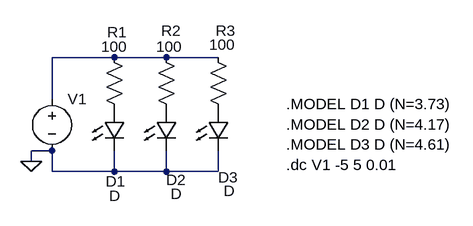
[diagram p0: schematic 131_LED.asc]
131_LED.asc, the LTspice schematic file:
Version 4
SHEET 1 880 680
WIRE 272 240 176 240
WIRE 352 240 272 240
WIRE 432 240 352 240
WIRE 176 304 176 240
WIRE 176 384 144 384
WIRE 144 400 144 384
WIRE 176 416 176 384
WIRE 272 416 272 384
WIRE 272 416 176 416
WIRE 352 416 352 384
WIRE 352 416 272 416
WIRE 432 416 432 384
WIRE 432 416 352 416
FLAG 144 400 0
SYMBOL voltage 176 288 R0
SYMATTR InstName V1
SYMATTR Value ""
SYMBOL Res 256 224 R0
WINDOW 0 5 -23 Left 2
WINDOW 3 -4 -1 Left 2
SYMATTR InstName R1
SYMATTR Value 100
SYMBOL Res 336 224 R0
WINDOW 0 8 -25 Left 2
WINDOW 3 0 -1 Left 2
SYMATTR InstName R2
SYMATTR Value 100
SYMBOL Res 416 224 R0
WINDOW 0 12 -25 Left 2
WINDOW 3 2 -4 Left 2
SYMATTR InstName R3
SYMATTR Value 100
SYMBOL LED 256 320 R0
WINDOW 0 3 111 Left 2
WINDOW 3 8 133 Left 2
SYMATTR InstName D1
SYMBOL LED 336 320 R0
WINDOW 0 16 109 Left 2
WINDOW 3 23 130 Left 2
SYMATTR InstName D2
SYMBOL LED 416 320 R0
WINDOW 0 16 105 Left 2
WINDOW 3 24 126 Left 2
SYMATTR InstName D3
TEXT 536 312 Left 2 !.MODEL D1 D (N=3.73)\n.MODEL D2 D (N=4.17)\n.MODEL D3 D (N=4.61)\n.dc V1 -5 5 0.01

The netlist it stands for:
* 131_LED.asc
V1 N001 0
R1 N001 P001 100
R2 N001 P002 100
R3 N001 P003 100
D1 P001 0 D
D2 P002 0 D
D3 P003 0 D
.model D D
.lib standard.dio
.MODEL D1 D (N=3.73)
.MODEL D2 D (N=4.17)
.MODEL D3 D (N=4.61)
.dc V1 -5 5 0.01
.backanno
.end